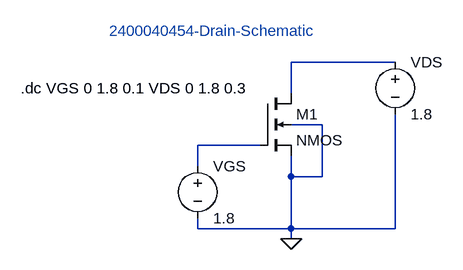
[diagram p0: schematic 2400040454-NMOS.asc]
2400040454-NMOS.asc, the LTspice schematic file:
Version 4.1
SHEET 1 880 680
WIRE 368 80 208 80
WIRE 208 128 208 80
WIRE 256 176 208 176
WIRE 160 208 64 208
WIRE 64 240 64 208
WIRE 208 256 208 224
WIRE 256 256 256 176
WIRE 256 256 208 256
WIRE 64 336 64 320
WIRE 208 336 208 256
WIRE 208 336 64 336
WIRE 368 336 368 160
WIRE 368 336 208 336
WIRE 208 352 208 336
FLAG 208 352 0
SYMBOL nmos4 160 128 R0
SYMATTR InstName M1
SYMBOL voltage 64 224 R0
SYMATTR InstName VGS
SYMATTR Value 1.8
SYMBOL voltage 368 64 R0
SYMATTR InstName VDS
SYMATTR Value 1.8
TEXT -208 120 Left 2 !.dc VGS 0 1.8 0.1 VDS 0 1.8 0.3
TEXT -72 32 Left 2 ;2400040454-Drain-Schematic

The netlist it stands for:
* 2400040454-NMOS.asc
M1 N001 N002 0 0 NMOS
VGS N002 0 1.8
VDS N001 0 1.8
.model NMOS NMOS
.model PMOS PMOS
.lib standard.mos
.dc VGS 0 1.8 0.1 VDS 0 1.8 0.3
* 2400040454-Drain-Schematic
.backanno
.end